# Altium project Li_PR.PrjPCB
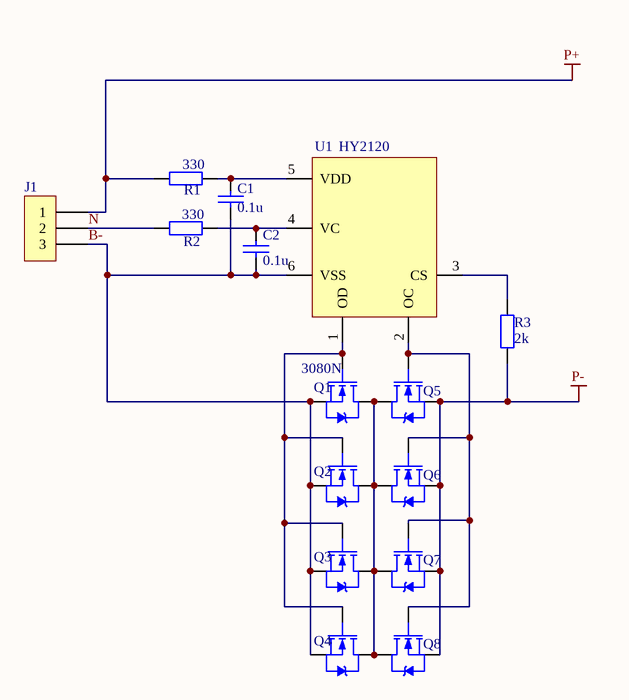
[diagram p0: LI_PR2.SchDoc]
1 sheet, 15 parts. Net scope: global (net labels, ports and power ports of the same name join across sheets).
Board file: LI-PR2.PcbDoc

## Sheet LI_PR2.SchDoc
size A4

### Parts
C1  0.1u  [CAP_0805C]
C2  0.1u  [CAP_0805C]
J1  HEADER_3  [HEADER_3]  (value not drawn)
Q1  3080N  [252-2]
Q2  3080N  [252-2]  (value not drawn)
Q3  3080N  [252-2]  (value not drawn)
Q4  3080N  [252-2]  (value not drawn)
Q5  3080N  [252-2]  (value not drawn)
Q6  3080N  [252-2]  (value not drawn)
Q7  3080N  [252-2]  (value not drawn)
Q8  3080N  [252-2]  (value not drawn)
R1  value 330  [R_0805R]  (hidden comment: R)
R2  value 330  [R_0805R]  (hidden comment: R)
R3  value 2k  [R_0805R]  (hidden comment: R)
U1  HY2120  [SOT-23-6]

### Nets
P+: J1.1 R1.1
P-: Q5.3(S) Q6.3(S) Q7.3(S) Q8.3(S) R3.1
B-: C1.1 C2.1 J1.3 Q1.3(S) Q2.3(S) Q3.3(S) Q4.3(S) U1.6(VSS)
N: J1.2 R2.1
NetC1_2: C1.2 R1.2 U1.5(VDD)
NetC2_2: C2.2 R2.2 U1.4(VC)
NetQ1_1: Q1.1(G) Q2.1(G) Q3.1(G) Q4.1(G) U1.1(OD)
NetQ1_2: Q1.2(D) Q2.2(D) Q3.2(D) Q4.2(D) Q5.2(D) Q6.2(D) Q7.2(D) Q8.2(D)
NetQ5_1: Q5.1(G) Q6.1(G) Q7.1(G) Q8.1(G) U1.2(OC)
NetR3_2: R3.2 U1.3(CS)

### Library data of the parts
C1 C2 = CAP2
Q1-Q8 = LR7843
R1-R3 = Res2